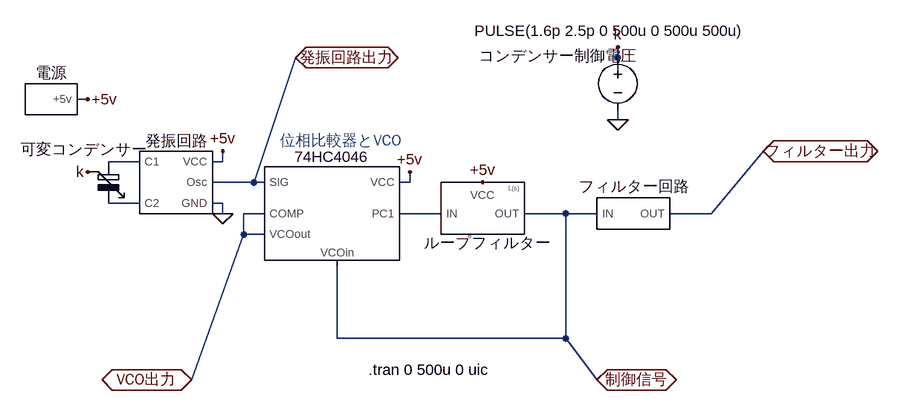
[diagram p0: schematic PLL.asc]
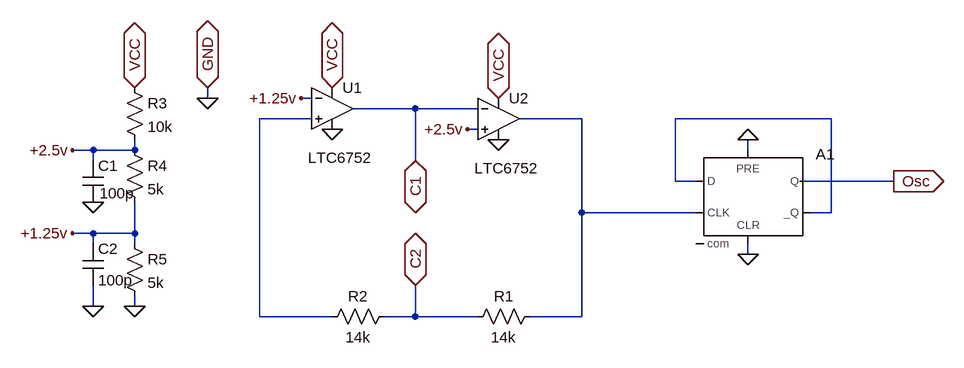
[diagram p1: sub-circuit oscilator.asc]
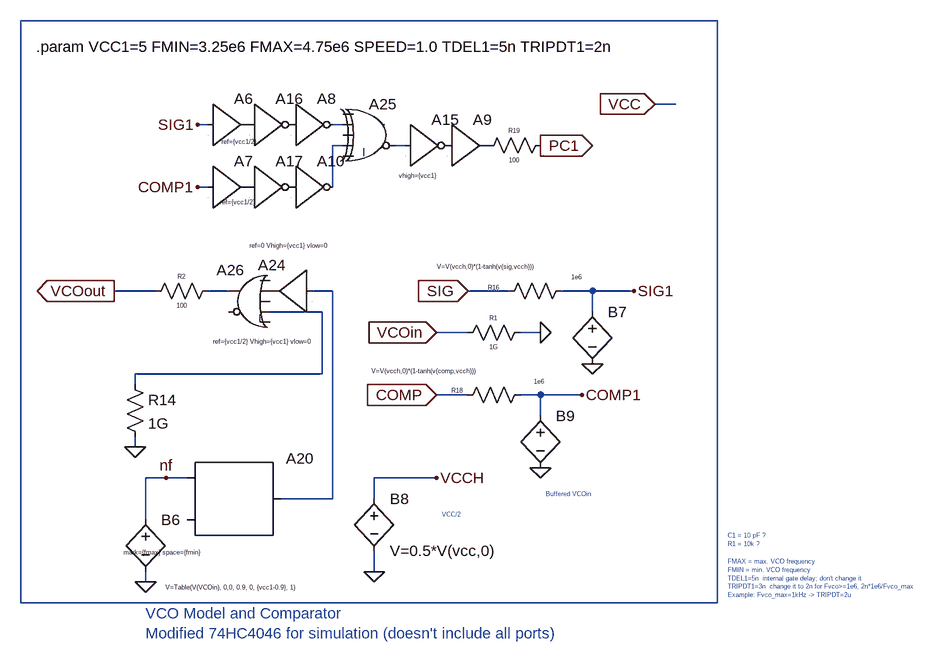
[diagram p2: sub-circuit 74hc4046.asc]
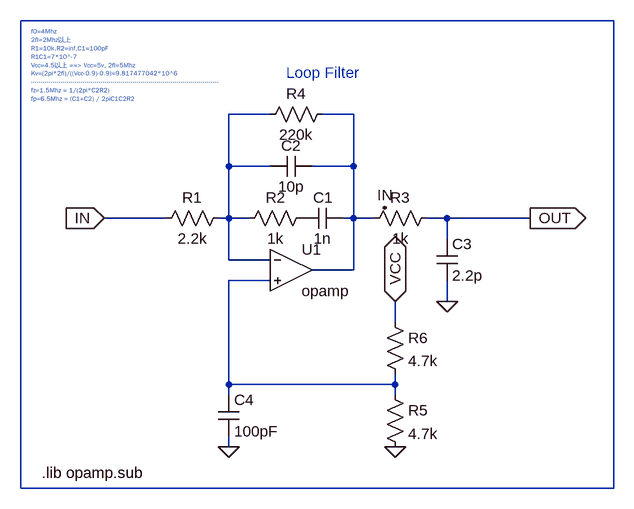
[diagram p3: sub-circuit loopfilter.asc]
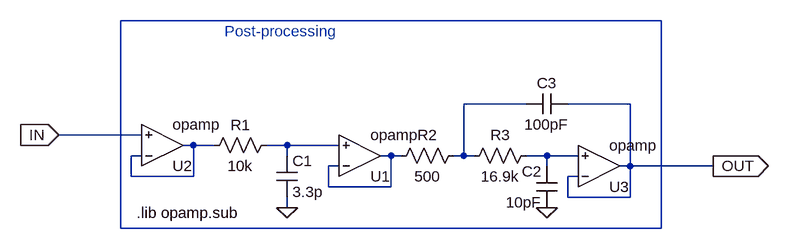
[diagram p4: sub-circuit post-filter.asc]
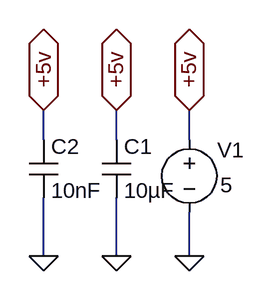
[diagram p5: sub-circuit sources.asc]
PLL.asc, the LTspice schematic file:
Version 4
SHEET 1 3520 1976
WIRE -1616 336 -1616 320
WIRE -1616 368 -1616 336
WIRE -2432 400 -2448 400
WIRE -1616 432 -1616 416
WIRE -2352 496 -2400 496
WIRE -2224 496 -2224 480
WIRE -2224 496 -2240 496
WIRE -2176 528 -2112 336
WIRE -2176 528 -2240 528
WIRE -2160 528 -2176 528
WIRE -1936 528 -1936 512
WIRE -1936 528 -1952 528
WIRE -2352 560 -2400 560
WIRE -2224 560 -2240 560
WIRE -2224 576 -2224 560
WIRE -2160 576 -2192 576
WIRE -1888 576 -1952 576
WIRE -1696 576 -1760 576
WIRE -1648 576 -1696 576
WIRE -1472 576 -1392 480
WIRE -1472 576 -1536 576
WIRE -2192 608 -2192 576
WIRE -2160 608 -2192 608
WIRE -2048 768 -2048 656
WIRE -1696 768 -1696 576
WIRE -1696 768 -2048 768
WIRE -2272 832 -2192 608
WIRE -1648 832 -1696 768
FLAG -1648 832 制御信号
IOPIN -1648 832 BiDir
FLAG -1616 432 0
FLAG -2224 480 +5v
FLAG -2224 576 0
FLAG -1936 512 +5v
FLAG -1824 528 +5v
FLAG -2432 400 +5v
FLAG -1392 480 フィルター出力
IOPIN -1392 480 BiDir
FLAG -2112 336 発振回路出力
IOPIN -2112 336 BiDir
FLAG -2432 512 k
FLAG -1616 320 k
FLAG -2272 832 VCO出力
IOPIN -2272 832 BiDir
SYMBOL voltage -1616 320 R0
WINDOW 3 -221 -25 Left 2
WINDOW 123 0 0 Left 0
WINDOW 39 0 0 Left 0
WINDOW 0 -214 14 Left 2
SYMATTR Value PULSE(1.6p 2.5p 0 500u 0 500u 500u)
SYMATTR InstName コンデンサー制御電圧
SYMBOL Variable-Capacitor -2416 496 R0
WINDOW 0 -119 -18 Left 2
SYMATTR InstName 可変コンデンサー
SYMBOL Oscilator -2304 528 R0
SYMATTR InstName 発振回路
SYMBOL 74HC4046 -2064 576 R0
SYMATTR InstName 74HC4046
SYMBOL LoopFilter -1840 576 R0
WINDOW 0 24 61 Bottom 2
SYMATTR InstName ループフィルター
SYMBOL Post-Filter -1600 576 R0
WINDOW 0 10 -26 Bottom 2
SYMATTR InstName フィルター回路
SYMBOL sources -2496 400 R0
SYMATTR InstName 電源
TEXT -2000 816 Left 2 !.tran 0 500u 0 uic
TEXT -2136 464 Left 2 ;位相比較器とVCO

oscilator.asc, the sub-circuit schematic file:
Version 4
SHEET 1 880 680
WIRE -320 -64 -320 -80
WIRE -160 -64 -176 -64
WIRE 0 -48 -96 -48
WIRE 96 -48 0 -48
WIRE -160 -32 -240 -32
WIRE 256 -32 160 -32
WIRE 640 -32 400 -32
WIRE 96 -16 80 -16
WIRE -496 16 -528 16
WIRE -432 16 -432 0
WIRE -432 16 -496 16
WIRE 512 16 512 0
WIRE -496 32 -496 16
WIRE 0 32 0 -48
WIRE 400 64 400 -32
WIRE 432 64 400 64
WIRE 736 64 592 64
WIRE 256 112 256 -32
WIRE 432 112 256 112
WIRE 640 112 640 -32
WIRE 640 112 608 112
WIRE -496 144 -528 144
WIRE -432 144 -432 96
WIRE -432 144 -496 144
WIRE -496 160 -496 144
WIRE -432 160 -432 144
WIRE 512 176 512 160
WIRE -496 256 -496 224
WIRE -432 256 -432 240
WIRE -240 272 -240 -32
WIRE -128 272 -240 272
WIRE 0 272 0 224
WIRE 0 272 -48 272
WIRE 96 272 0 272
WIRE 256 272 256 112
WIRE 256 272 176 272
FLAG -128 -16 0
FLAG 128 0 0
FLAG -176 -64 +1.25v
FLAG 80 -16 +2.5v
FLAG 512 176 0
FLAG 512 0 0
FLAG 0 32 C1
IOPIN 0 32 BiDir
FLAG 0 224 C2
IOPIN 0 224 BiDir
FLAG 736 64 Osc
IOPIN 736 64 Out
FLAG -432 -80 VCC
IOPIN -432 -80 BiDir
FLAG -496 96 0
FLAG -528 16 +2.5v
FLAG -432 256 0
FLAG -496 256 0
FLAG -528 144 +1.25v
FLAG -128 -80 VCC
IOPIN -128 -80 BiDir
FLAG 128 -64 VCC
IOPIN 128 -64 BiDir
FLAG -320 -80 GND
IOPIN -320 -80 BiDir
FLAG -320 -64 0
SYMBOL Comparators\\LTC6752 -128 -112 R0
WINDOW 3 -37 140 Left 2
SYMATTR InstName U1
SYMBOL res 192 256 R90
WINDOW 0 0 56 VBottom 2
WINDOW 3 32 56 VTop 2
SYMATTR InstName R1
SYMATTR Value 14k
SYMBOL res -32 256 R90
WINDOW 0 0 56 VBottom 2
WINDOW 3 32 56 VTop 2
SYMATTR InstName R2
SYMATTR Value 14k
SYMBOL Comparators\\LTC6752 128 -96 R0
WINDOW 3 -37 140 Left 2
SYMATTR InstName U2
SYMBOL Digital\\dflop 512 16 R0
SYMATTR InstName A1
SYMATTR SpiceLine vhigh=5
SYMBOL res -448 -96 R0
SYMATTR InstName R3
SYMATTR Value 10k
SYMBOL res -448 0 R0
SYMATTR InstName R4
SYMATTR Value 5k
SYMBOL cap -512 32 R0
WINDOW 3 26 50 Left 2
SYMATTR Value 100p
SYMATTR InstName C1
SYMBOL res -448 144 R0
SYMATTR InstName R5
SYMATTR Value 5k
SYMBOL cap -512 160 R0
SYMATTR InstName C2
SYMATTR Value 100p

74hc4046.asc, the sub-circuit schematic file:
Version 4
SHEET 1 3580 1976
WIRE 3248 48 2176 48
WIRE 3184 176 3152 176
WIRE 2464 208 2448 208
WIRE 2672 208 2656 208
WIRE 2672 240 2656 240
WIRE 2768 240 2752 240
WIRE 2464 304 2448 304
WIRE 2656 304 2656 240
WIRE 2384 464 2320 464
WIRE 2496 464 2464 464
WIRE 2656 464 2624 464
WIRE 2928 464 2864 464
WIRE 3056 464 3008 464
WIRE 3120 464 3056 464
WIRE 2640 496 2560 496
WIRE 3056 496 3056 464
WIRE 2864 528 2816 528
WIRE 2976 528 2944 528
WIRE 2640 592 2640 496
WIRE 2640 592 2352 592
WIRE 2352 608 2352 592
WIRE 2864 624 2816 624
WIRE 2976 624 2944 624
WIRE 3040 624 2976 624
WIRE 2976 656 2976 624
WIRE 2352 704 2352 688
WIRE 2400 752 2368 752
WIRE 2432 752 2400 752
WIRE 2816 752 2720 752
WIRE 2656 784 2656 464
WIRE 2656 784 2576 784
WIRE 2720 784 2720 752
WIRE 2368 816 2368 752
WIRE 2720 896 2720 864
WIRE 2368 912 2368 896
WIRE 2176 944 2176 48
WIRE 3248 944 3248 48
WIRE 3248 944 2176 944
FLAG 2448 208 SIG1
FLAG 2448 304 COMP1
FLAG 2976 240 PC1
IOPIN 2976 240 Out
FLAG 2400 752 nf
FLAG 2368 912 0
FLAG 2816 528 VCOin
IOPIN 2816 528 In
FLAG 2320 464 VCOout
IOPIN 2320 464 Out
FLAG 2352 704 0
FLAG 2976 528 0
FLAG 2720 896 0
FLAG 2816 752 VCCH
FLAG 3056 576 0
FLAG 2864 464 SIG
IOPIN 2864 464 In
FLAG 3120 464 SIG1
FLAG 2976 736 0
FLAG 2816 624 COMP
IOPIN 2816 624 In
FLAG 3040 624 COMP1
FLAG 3152 176 VCC
IOPIN 3152 176 In
SYMBOL Digital\\buf1 2464 144 R0
WINDOW 3 21 90 Left 0
SYMATTR Value ref={vcc1/2}
SYMATTR InstName A6
SYMBOL Digital\\buf1 2464 240 R0
WINDOW 3 19 87 Left 0
SYMATTR Value ref={vcc1/2}
SYMATTR InstName A7
SYMBOL Digital\\inv 2592 144 R0
WINDOW 3 -52 103 Invisible 0
SYMATTR Value td={0.5*tdel1} tripdt={tripdt1}
SYMATTR InstName A8
SYMBOL Digital\\buf1 2832 176 R0
WINDOW 3 -47 95 Invisible 0
WINDOW 39 -74 110 Left 0
SYMATTR Value td={tdel1} tripdt={tripdt1}
SYMATTR SpiceLine vhigh={vcc1}
SYMATTR InstName A9
SYMATTR Value2 ref=0.5
SYMBOL Digital\\inv 2592 240 R0
WINDOW 3 -52 103 Invisible 0
SYMATTR Value td={0.5*tdel1} tripdt={tripdt1}
SYMATTR InstName A10
SYMBOL Digital\\inv 2768 176 R0
WINDOW 3 -52 103 Invisible 0
SYMATTR Value td={tdel1} tripdt={tripdt1}
SYMATTR InstName A15
SYMBOL Digital\\inv 2528 144 R0
WINDOW 3 -52 103 Invisible 0
SYMATTR Value td={0.5*tdel1} tripdt={tripdt1}
SYMATTR InstName A16
SYMBOL Digital\\inv 2528 240 R0
WINDOW 3 -52 103 Invisible 0
SYMATTR Value td={0.5*tdel1} tripdt={tripdt1}
SYMATTR InstName A17
SYMBOL SpecialFunctions\\modulate 2432 752 R0
WINDOW 3 -98 114 Left 0
SYMATTR Value mark={fmax} space={fmin}
SYMATTR InstName A20
SYMBOL Digital\\buf1 2624 400 M0
WINDOW 3 -24 -6 Left 0
SYMATTR Value ref=0 Vhigh={vcc1} vlow=0
SYMATTR InstName A24
SYMATTR Value2 td={tdel1} tripdt={tripdt1}
SYMBOL Digital\\xor 2720 160 R0
WINDOW 3 16 52 Invisible 0
SYMATTR Value td={tdel1} tripdt={tripdt1}
SYMATTR InstName A25
SYMBOL bv 2368 800 R0
WINDOW 3 31 120 Left 0
SYMATTR Value V=Table(V(VCOin), 0,0, 0.9, 0, {vcc1-0.9}, 1)
SYMATTR InstName B6
SYMBOL res 2848 544 R270
WINDOW 0 32 56 VTop 0
WINDOW 3 0 56 VBottom 0
SYMATTR InstName R1
SYMATTR Value 1G
SYMBOL res 2368 480 R270
WINDOW 0 32 56 VTop 0
WINDOW 3 0 56 VBottom 0
SYMATTR InstName R2
SYMATTR Value 100
SYMBOL Digital\\or 2528 416 M0
WINDOW 3 -94 126 Left 0
SYMATTR Value ref={vcc1/2} Vhigh={vcc1} vlow=0
SYMATTR InstName A26
SYMBOL res 2336 592 R0
SYMATTR InstName R14
SYMATTR Value 1G
SYMBOL bv 3056 480 R0
WINDOW 3 -239 -54 Left 0
SYMATTR Value V=V(vcch,0)*(1-tanh(v(sig,vcch)))
SYMATTR InstName B7
SYMBOL bv 2720 768 R0
SYMATTR InstName B8
SYMATTR Value V=0.5*V(vcc,0)
SYMBOL res 2912 480 R270
WINDOW 0 15 -8 VTop 0
WINDOW 3 44 120 VBottom 0
SYMATTR InstName R16
SYMATTR Value 1e6
SYMBOL bv 2976 640 R0
WINDOW 3 -260 -53 Left 0
SYMATTR Value V=V(vcch,0)*(1-tanh(v(comp,vcch)))
SYMATTR InstName B9
SYMBOL res 2848 640 R270
WINDOW 0 16 0 VTop 0
WINDOW 3 43 126 VBottom 0
SYMATTR InstName R18
SYMATTR Value 1e6
SYMBOL res 2880 256 R270
WINDOW 0 32 56 VTop 0
WINDOW 3 0 56 VBottom 0
SYMATTR InstName R19
SYMATTR Value 100
TEXT 2824 808 Left 0 ;VCC/2
TEXT 2984 776 Left 0 ;Buffered VCOin
TEXT 2200 88 Left 2 !.param VCC1=5 FMIN=3.25e6 FMAX=4.75e6 SPEED=1.0 TDEL1=5n TRIPDT1=2n
TEXT 2368 960 Left 2 ;VCO Model and Comparator\nModified 74HC4046 for simulation (doesn't include all ports)
TEXT 3264 880 Left 0 ;FMAX = max. VCO frequency\nFMIN = min. VCO frequency\nTDEL1=5n  internal gate delay; don't change it\nTRIPDT1=3n  change it to 2n for Fvco>=1e6, 2n*1e6/Fvco_max\nExample: Fvco_max=1kHz -> TRIPDT=2u
TEXT 3264 840 Left 0 ;C1 = 10 pF ?\nR1 = 10k ?

loopfilter.asc, the sub-circuit schematic file:
Version 4
SHEET 1 880 680
WIRE 752 -224 -160 -224
WIRE 224 -80 160 -80
WIRE 352 -80 304 -80
WIRE 160 0 160 -80
WIRE 224 0 160 0
WIRE 352 0 352 -80
WIRE 352 0 288 0
WIRE 64 80 -32 80
WIRE 160 80 160 0
WIRE 160 80 144 80
WIRE 192 80 160 80
WIRE 352 80 352 0
WIRE 352 80 336 80
WIRE 384 80 352 80
WIRE 496 80 464 80
WIRE 624 80 496 80
WIRE 496 112 496 80
WIRE 160 144 160 80
WIRE 224 144 160 144
WIRE 352 160 352 80
WIRE 352 160 288 160
WIRE 224 176 160 176
WIRE 496 208 496 176
WIRE 416 240 416 208
WIRE 160 336 160 176
WIRE 416 336 416 320
WIRE 416 336 160 336
WIRE 160 352 160 336
WIRE 416 352 416 336
WIRE 160 432 160 416
WIRE -160 496 -160 -224
WIRE 752 496 752 -224
WIRE 752 496 -160 496
FLAG 160 432 0
FLAG 496 208 0
FLAG 416 208 VCC
IOPIN 416 208 BiDir
FLAG 416 432 0
FLAG 400 64 IN
FLAG -32 80 IN
IOPIN -32 80 In
FLAG 624 80 OUT
IOPIN 624 80 Out
SYMBOL res 160 64 R90
WINDOW 0 0 56 VBottom 2
WINDOW 3 32 56 VTop 2
SYMATTR InstName R1
SYMATTR Value 2.2k
SYMBOL res 288 64 R90
WINDOW 0 0 56 VBottom 2
WINDOW 3 32 56 VTop 2
SYMATTR InstName R2
SYMATTR Value 1k
SYMBOL cap 272 64 M90
WINDOW 0 0 33 VBottom 2
WINDOW 3 32 32 VTop 2
SYMATTR InstName C1
SYMATTR Value 1n
SYMBOL cap 288 -16 R90
WINDOW 0 0 32 VBottom 2
WINDOW 3 32 32 VTop 2
SYMATTR InstName C2
SYMATTR Value 10p
SYMBOL cap 480 112 R0
SYMATTR InstName C3
SYMATTR Value 2.2p
SYMBOL res 480 64 R90
WINDOW 0 0 56 VBottom 2
WINDOW 3 32 56 VTop 2
SYMATTR InstName R3
SYMATTR Value 1k
SYMBOL res 320 -96 R90
WINDOW 0 0 56 VBottom 2
WINDOW 3 32 56 VTop 2
SYMATTR InstName R4
SYMATTR Value 220k
SYMBOL cap 144 352 R0
SYMATTR InstName C4
SYMATTR Value 100pF
SYMBOL res 400 336 R0
SYMATTR InstName R5
SYMATTR Value 4.7k
SYMBOL res 400 224 R0
SYMATTR InstName R6
SYMATTR Value 4.7k
SYMBOL Opamps\\opamp 256 96 R0
SYMATTR InstName U1
SYMATTR SpiceLine2 GBW=40Meg
TEXT 248 -144 Left 2 ;Loop Filter
TEXT -128 472 Left 2 !.lib opamp.sub
TEXT -144 -208 Left 0 ;f0=4Mhz\n2fl=2Mhz以上\nR1=10k,R2=inf,C1=100pF\nR1C1=7*10^-7\nVcc=4.5以上 ==> Vcc=5v, 2fl=5Mhz\nKv=(2pi*2fl)/((Vcc-0.9)-0.9)=9.817477042*10^6\n----------------------------------------------------------------------------------------------\nfz=1.5Mhz = 1/(2pi*C2R2)\nfp=6.5Mhz = (C1+C2) / 2piC1C2R2

post-filter.asc, the sub-circuit schematic file:
Version 4
SHEET 1 880 680
WIRE 560 -48 -272 -48
WIRE 352 80 256 80
WIRE 512 80 416 80
WIRE -240 128 -368 128
WIRE -160 144 -176 144
WIRE -128 144 -160 144
WIRE -16 144 -48 144
WIRE 64 144 -16 144
WIRE -240 160 -256 160
WIRE -16 160 -16 144
WIRE 144 160 128 160
WIRE 160 160 144 160
WIRE 256 160 256 80
WIRE 256 160 240 160
WIRE 272 160 256 160
WIRE 384 160 352 160
WIRE 432 160 384 160
WIRE 64 176 48 176
WIRE 384 176 384 160
WIRE 512 176 512 80
WIRE 512 176 496 176
WIRE 640 176 512 176
WIRE -256 192 -256 160
WIRE -160 192 -160 144
WIRE -160 192 -256 192
WIRE 432 192 416 192
WIRE 48 208 48 176
WIRE 144 208 144 160
WIRE 144 208 48 208
WIRE 416 224 416 192
WIRE 512 224 512 176
WIRE 512 224 416 224
WIRE -16 240 -16 224
WIRE -272 272 -272 -48
WIRE 560 272 560 -48
WIRE 560 272 -272 272
FLAG -16 240 0
FLAG 384 240 0
FLAG -368 128 IN
IOPIN -368 128 In
FLAG 640 176 OUT
IOPIN 640 176 Out
SYMBOL Opamps\\opamp 96 224 M180
SYMATTR InstName U1
SYMATTR SpiceLine2 GBW=40Meg
SYMBOL res -32 128 R90
WINDOW 0 0 56 VBottom 2
WINDOW 3 32 56 VTop 2
SYMATTR InstName R1
SYMATTR Value 10k
SYMBOL cap -32 160 R0
SYMATTR InstName C1
SYMATTR Value 3.3p
SYMBOL Opamps\\opamp -208 208 M180
SYMATTR InstName U2
SYMATTR SpiceLine2 GBW=40Meg
SYMBOL Opamps\\opamp 464 240 M180
SYMATTR InstName U3
SYMATTR SpiceLine2 GBW=40Meg
SYMBOL res 256 144 R90
WINDOW 0 0 56 VBottom 2
WINDOW 3 32 56 VTop 2
SYMATTR InstName R2
SYMATTR Value 500
SYMBOL res 368 144 R90
WINDOW 0 0 56 VBottom 2
WINDOW 3 32 56 VTop 2
SYMATTR InstName R3
SYMATTR Value 16.9k
SYMBOL cap 400 240 R180
WINDOW 0 24 56 Left 2
WINDOW 3 24 8 Left 2
SYMATTR InstName C2
SYMATTR Value 10pF
SYMBOL cap 416 64 R90
WINDOW 0 0 32 VBottom 2
WINDOW 3 32 32 VTop 2
SYMATTR InstName C3
SYMATTR Value 100pF
TEXT -112 -32 Left 2 ;Post-processing
TEXT -248 248 Left 2 !.lib opamp.sub

sources.asc, the sub-circuit schematic file:
Version 4
SHEET 1 880 680
WIRE 112 144 112 112
WIRE 192 144 192 112
WIRE 272 144 272 112
WIRE 112 272 112 208
WIRE 192 272 192 208
WIRE 272 272 272 224
FLAG 192 272 0
FLAG 112 272 0
FLAG 272 272 0
FLAG 112 112 +5v
IOPIN 112 112 BiDir
FLAG 192 112 +5v
IOPIN 192 112 BiDir
FLAG 272 112 +5v
IOPIN 272 112 BiDir
SYMBOL voltage 272 128 R0
WINDOW 0 31 28 Left 2
WINDOW 3 34 66 Left 2
WINDOW 123 0 0 Left 0
WINDOW 39 0 0 Left 0
SYMATTR InstName V1
SYMATTR Value 5
SYMBOL cap 176 144 R0
SYMATTR InstName C1
SYMATTR Value 10µF
SYMBOL cap 96 144 R0
SYMATTR InstName C2
SYMATTR Value 10nF

The netlist it stands for:
* PLL.asc
V§コンデンサー制御電圧 k 0 PULSE(1.6p 2.5p 0 500u 0 500u 500u)
X可変コンデンサー N001 N002 k Variable-Capacitor  ; pins C+ C- K
X発振回路 N001 N002 発振回路出力 +5v 0 oscilator
X74HC4046 VCO出力 発振回路出力 +5v 制御信号 N003 VCO出力 74hc4046
Xループフィルター N003 制御信号 +5v loopfilter
Xフィルター回路 制御信号 フィルター出力 post-filter
X電源 +5v sources

* block symbol definitions
.subckt oscilator C1 C2 Osc VCC GND
XU1 N001 +1.25v VCC 0 C1 LTC6752  ; pins In+ In- V+ V- OUT
R1 N002 C2 14k
R2 C2 N001 14k
XU2 +2.5v C1 VCC 0 N002 LTC6752  ; pins In+ In- V+ V- OUT
A1 N003 0 N002 0 0 N003 Osc 0 DFLOP vhigh=5
R3 VCC +2.5v 10k
R4 +2.5v +1.25v 5k
C1 +2.5v 0 100p
R5 +1.25v 0 5k
C2 +1.25v 0 100p
.ends oscilator

.subckt 74hc4046 COMP SIG VCC VCOin PC1 VCOout
A6 SIG1 0 0 0 0 0 P001 0 BUF ref={vcc1/2}
A7 COMP1 0 0 0 0 0 P002 0 BUF ref={vcc1/2}
A8 P003 0 0 0 0 N002 0 0 BUF td={0.5*tdel1} tripdt={tripdt1}
A9 P004 0 0 0 0 0 P005 0 BUF td={tdel1} tripdt={tripdt1} ref=0.5 vhigh={vcc1}
A10 P006 0 0 0 0 N003 0 0 BUF td={0.5*tdel1} tripdt={tripdt1}
A15 N004 0 0 0 0 P004 0 0 BUF td={tdel1} tripdt={tripdt1}
A16 P001 0 0 0 0 P003 0 0 BUF td={0.5*tdel1} tripdt={tripdt1}
A17 P002 0 0 0 0 P006 0 0 BUF td={0.5*tdel1} tripdt={tripdt1}
A20 nf 0 0 0 0 0 N006 0 MODULATOR mark={fmax} space={fmin}
A24 N006 0 0 0 0 0 P007 0 BUF ref=0 Vhigh={vcc1} vlow=0 td={tdel1} tripdt={tripdt1}
A25 0 N002 0 N003 0 N004 0 0 XOR td={tdel1} tripdt={tripdt1}
B6 nf 0 V=Table(V(VCOin), 0,0, 0.9, 0, {vcc1-0.9}, 1)
R1 VCOin 0 1G
R2 VCOout N005 100
A26 0 P007 0 N007 0 0 N005 0 OR ref={vcc1/2} Vhigh={vcc1} vlow=0
R14 N007 0 1G
B7 SIG1 0 V=V(vcch,0)*(1-tanh(v(sig,vcch)))
B8 VCCH 0 V=0.5*V(vcc,0)
R16 SIG SIG1 1e6
B9 COMP1 0 V=V(vcch,0)*(1-tanh(v(comp,vcch)))
R18 COMP COMP1 1e6
R19 P005 PC1 100
* VCC/2
* Buffered VCOin
.param VCC1=5 FMIN=3.25e6 FMAX=4.75e6 SPEED=1.0 TDEL1=5n TRIPDT1=2n
* VCO Model and Comparator
* Modified 74HC4046 for simulation (doesn't include all ports)
* FMAX = max. VCO frequency
* FMIN = min. VCO frequency
* TDEL1=5n  internal gate delay; don't change it
* TRIPDT1=3n  change it to 2n for Fvco>=1e6, 2n*1e6/Fvco_max
* Example: Fvco_max=1kHz -> TRIPDT=2u
* C1 = 10 pF ?
* R1 = 10k ?
.ends 74hc4046

.subckt loopfilter IN OUT VCC
R1 N002 IN 2.2k
R2 P001 N002 1k
C1 P001 N003 1n
C2 N003 N002 10p
C3 OUT 0 2.2p
R3 OUT N003 1k
R4 N003 N002 220k
C4 N004 0 100pF
R5 N004 0 4.7k
R6 VCC N004 4.7k
XU1 N002 N004 N003 opamp Aol=100K GBW=40Meg  ; pins invin noninvin out
* Loop Filter
.lib opamp.sub
* f0=4Mhz
* 2fl=2Mhz以上
* R1=10k,R2=inf,C1=100pF
* R1C1=7*10^-7
* Vcc=4.5以上 ==> Vcc=5v, 2fl=5Mhz
* Kv=(2pi*2fl)/((Vcc-0.9)-0.9)=9.817477042*10^6
* ----------------------------------------------------------------------------------------------
* fz=1.5Mhz = 1/(2pi*C2R2)
* fp=6.5Mhz = (C1+C2) / 2piC1C2R2
.ends loopfilter

.subckt post-filter IN OUT
XU1 N005 N004 N005 opamp Aol=100K GBW=40Meg  ; pins invin noninvin out
R1 N004 N003 10k
C1 N004 0 3.3p
XU2 N003 IN N003 opamp Aol=100K GBW=40Meg  ; pins invin noninvin out
XU3 OUT N006 OUT opamp Aol=100K GBW=40Meg  ; pins invin noninvin out
R2 N002 N005 500
R3 N006 N002 16.9k
C2 0 N006 10pF
C3 OUT N002 100pF
* Post-processing
.lib opamp.sub
.ends post-filter

.subckt sources +5v
V1 +5v 0 5
C1 +5v 0 10µF
C2 +5v 0 10nF
.ends sources

.tran 0 500u 0 uic
* 位相比較器とVCO
.lib LTC7.lib
.backanno
.end